# EAGLE design BreadBoard (EAGLE 6.4)
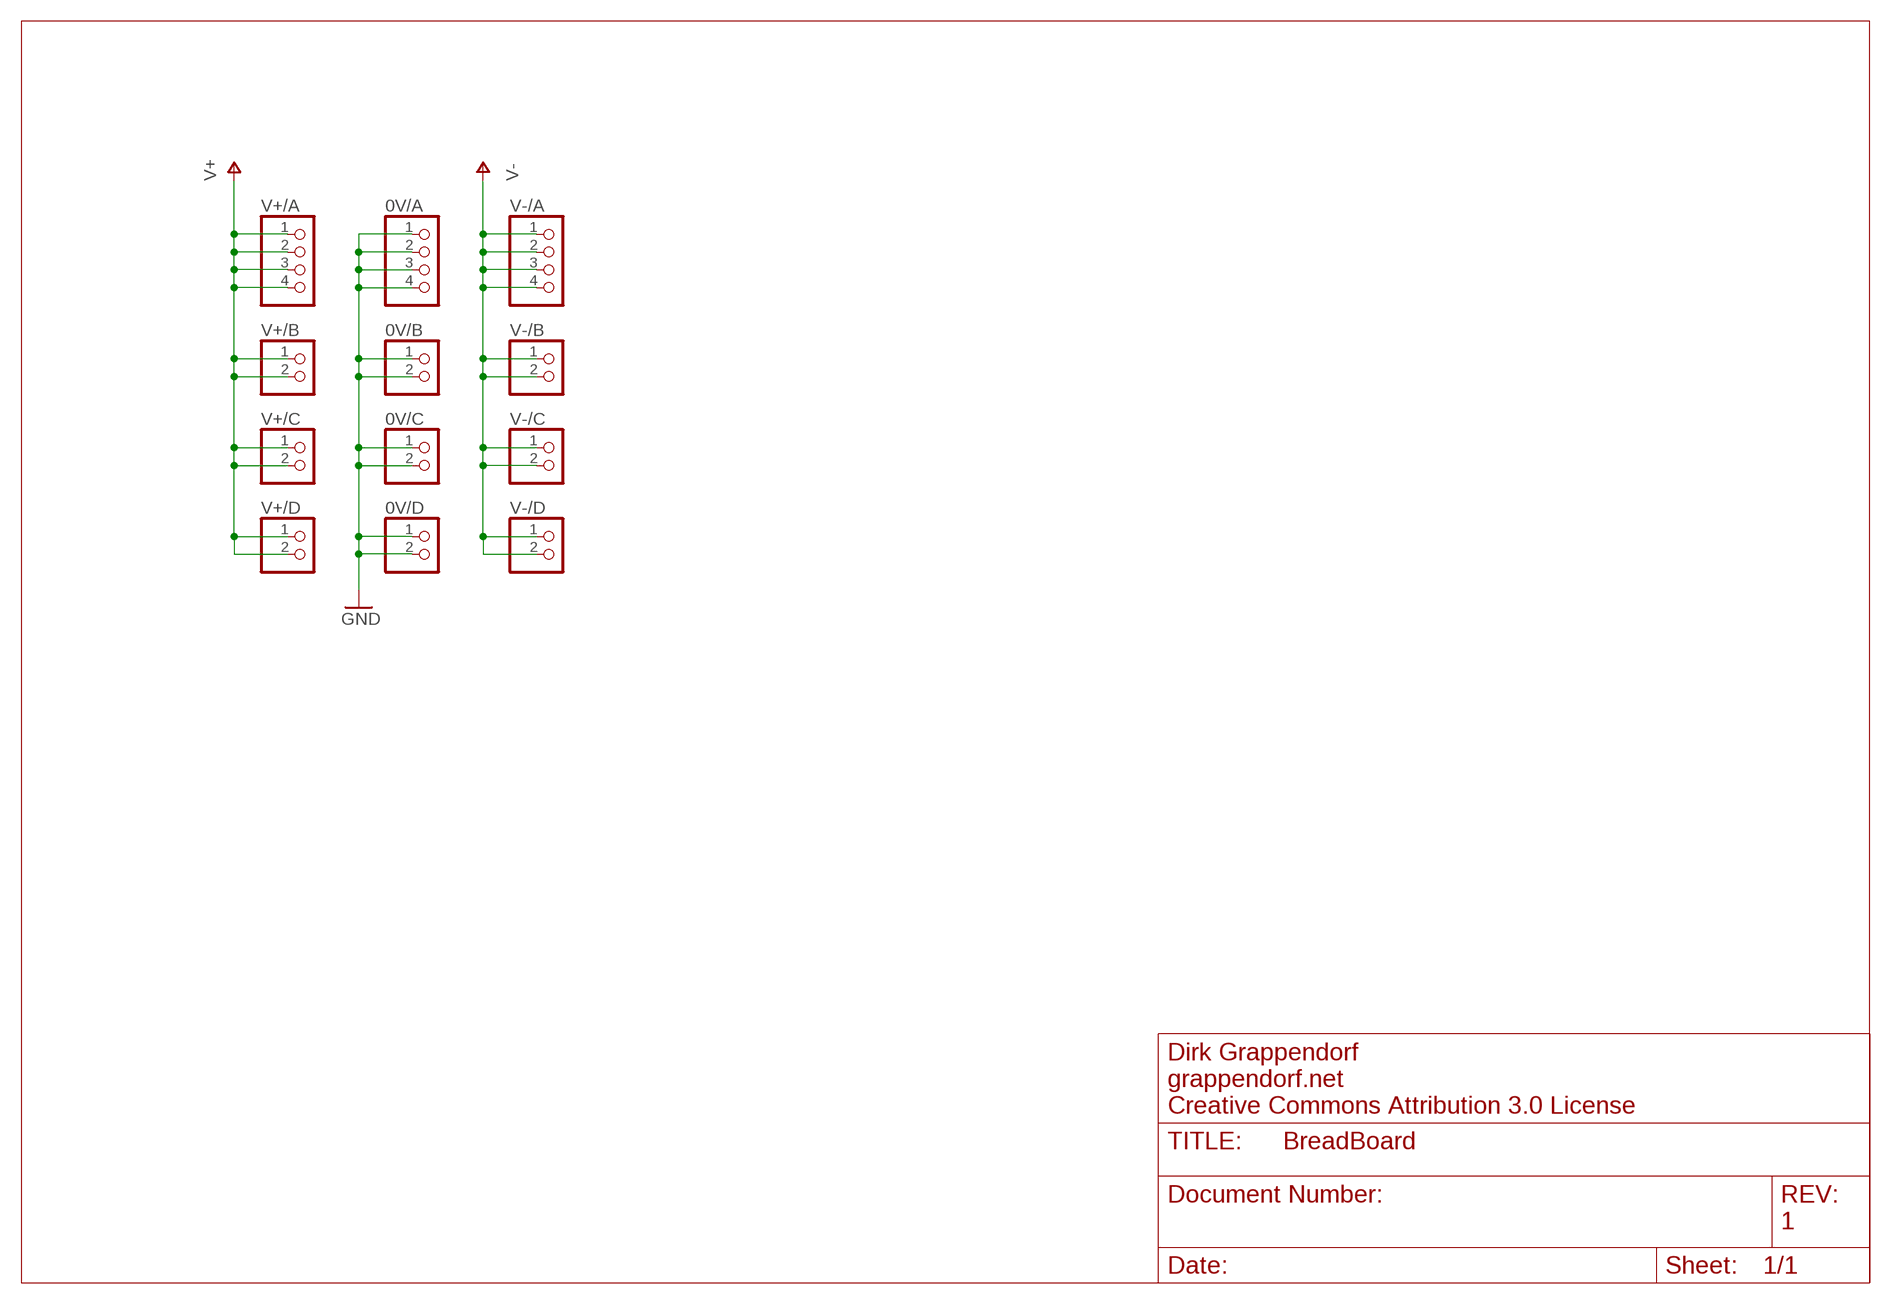
[diagram p0: schematic, sheet 1]

## Parts
0V/A  PINHD-1X4  [1X04]
0V/B  PINHD-1X2  [1X02]
0V/C  PINHD-1X2  [1X02]
0V/D  PINHD-1X2  [1X02]
V+/A  PINHD-1X4  [1X04]
V+/B  PINHD-1X2  [1X02]
V+/C  PINHD-1X2  [1X02]
V+/D  PINHD-1X2  [1X02]
V-/A  PINHD-1X4  [1X04]
V-/B  PINHD-1X2  [1X02]
V-/C  PINHD-1X2  [1X02]
V-/D  PINHD-1X2  [1X02]

## Nets
GND: 0V/A.1 0V/A.2 0V/A.3 0V/A.4 0V/B.1 0V/B.2 0V/C.1 0V/C.2 0V/D.1 0V/D.2
V+: V+/A.1 V+/A.2 V+/A.3 V+/A.4 V+/B.1 V+/B.2 V+/C.1 V+/C.2 V+/D.1 V+/D.2
V-: V-/A.1 V-/A.2 V-/A.3 V-/A.4 V-/B.1 V-/B.2 V-/C.1 V-/C.2 V-/D.1 V-/D.2

## Notes on the sheet
- Dirk Grappendorf
- grappendorf.net
- Creative Commons Attribution 3.0 License
- 1

## Library data of the parts
0V/A V+/A V-/A = pinhead:PINHD-1X4: PIN HEADER
0V/B 0V/C 0V/D V+/B V+/C V+/D V-/B V-/C V-/D = pinhead:PINHD-1X2: PIN HEADER

## Board
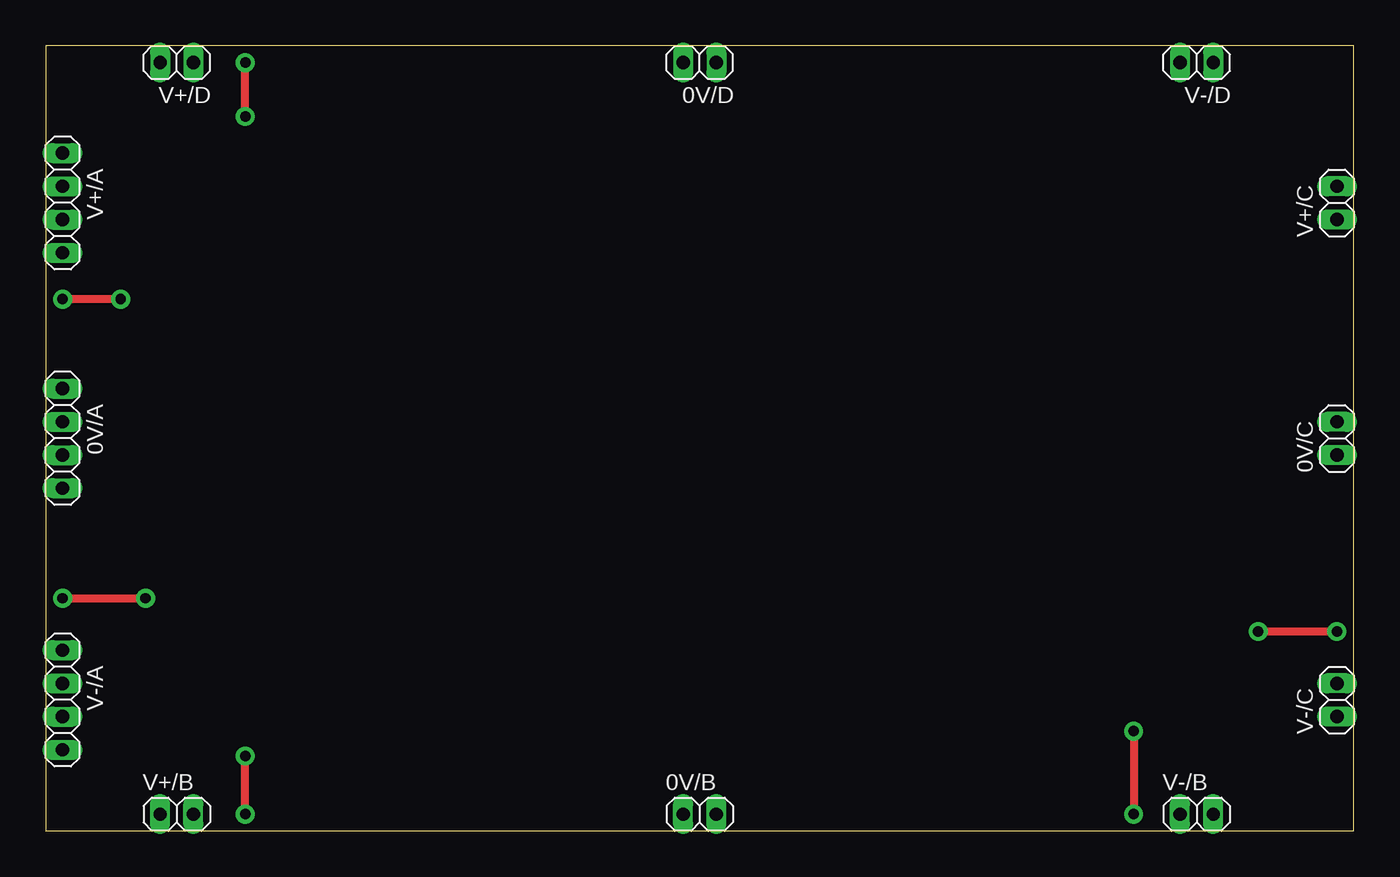
[diagram p1: board, top side]
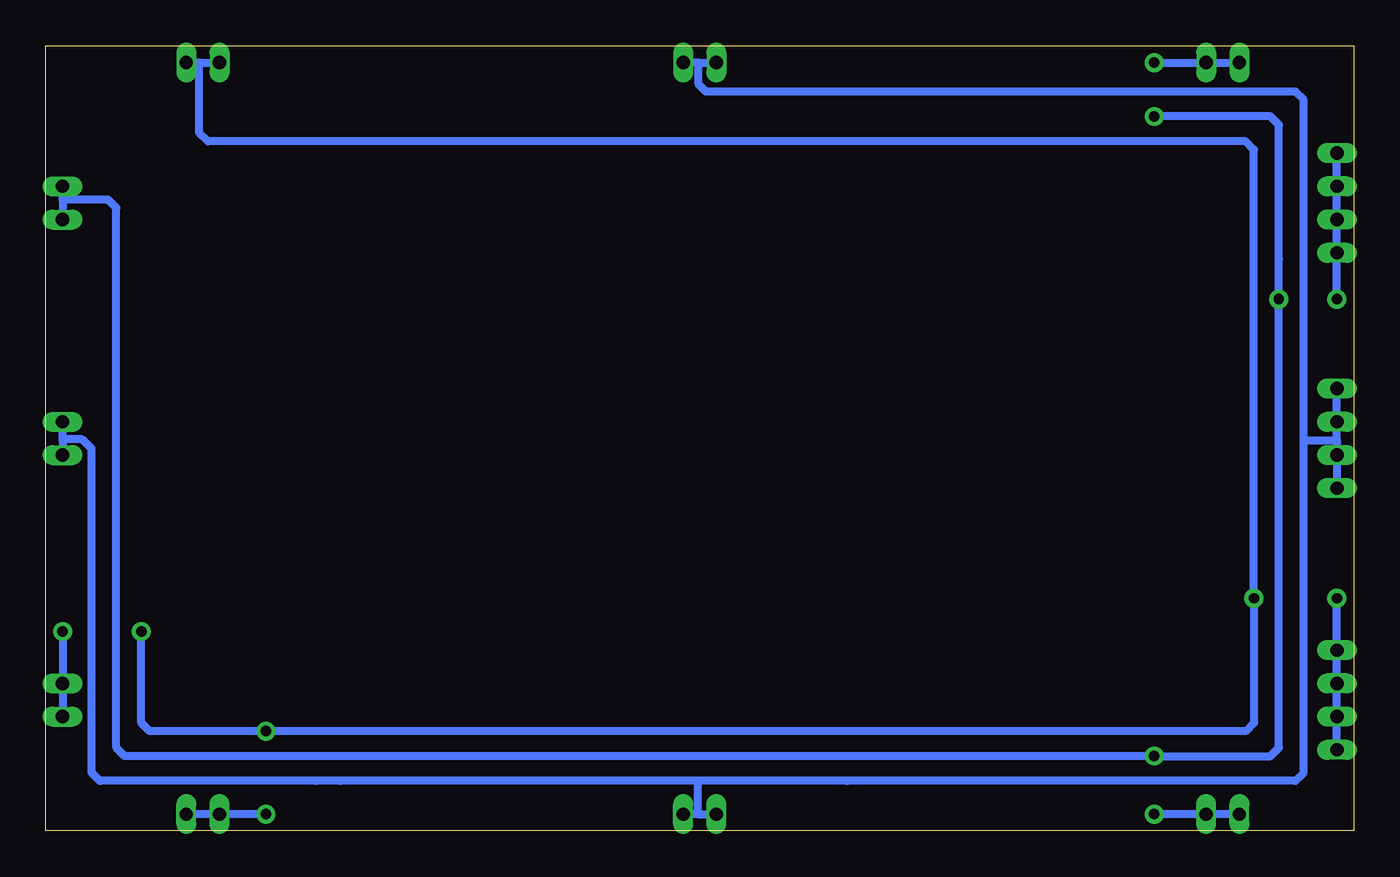
[diagram p2: board, bottom side, seen from below]

Size 100 x 60 mm. Coordinates in mm from the lower left corner, seen from the top.
Outline: 0,0 100,0 100,60 0,60 0,0
Copper layers (1*16): Top 0.035mm / dielectric 1.5mm / Bottom 0.035mm
Design rules "default *": minimum track width 10mil, minimum drill 24mil, track to track 8mil, track to pad 8mil, pad to pad 8mil, via to via 8mil, smd to smd 8mil, copper to edge 40mil, drill to drill 8mil, minimum pad ring 10mil, minimum via ring 8mil, stop-mask expansion 4mil, vias tented up to drill 0mil, thermal gap 10mil

### Footprints (pad centres in the part's own frame; a part is rotated, then mirrored left to right if it is on the bottom)
1X04 = drill 1.016 long: 1 -3.81,0; 2 -1.27,0; 3 1.27,0; 4 3.81,0
1X02 = drill 1.016 long: 1 -1.27,0; 2 1.27,0

### Placement (x,y rotation side)
0V/A  1.27,30 270 top
0V/B  50,1.27 0 top
0V/C  98.73,30 90 top
0V/D  50,58.73 180 top
V+/A  1.27,48 270 top
V+/B  10,1.27 0 top
V+/C  98.73,48 90 top
V+/D  10,58.73 180 top
V-/A  1.27,10 270 top
V-/B  88,1.27 0 top
V-/C  98.73,10 90 top
V-/D  88,58.73 180 top

### Tracks (layer width: path | path; a pad name or v marks a point on that pad's centre or on a via)
GND
  Bottom 0.61: 50.08,58.73 0V/D.2 | 50.08,58.73 0V/D.1 | 98.73,29.93 0V/C.1 98.48,28.48 | 98.73,29.93 0V/C.2 | 50.16,1.27 0V/B.1 | 50.16,1.27 0V/B.2 | 3.81,29.84 3.81,5.08 3.81,4.45 4.45,3.81 38.73,3.81 50.16,3.81 | 3.81,29.84 3.81,55.88 4.45,56.52 49.53,56.52 50.08,57.06 50.08,58.73 | 50.16,3.81 77.47,3.81 | 77.47,3.81 79.38,3.81 | 79.38,3.81 95.89,3.81 96.52,4.45 96.52,29.21 97.24,29.93 98.73,29.93 | 50.16,3.81 50.16,1.27 | 77.47,3.81 79.38,3.81 | 0V/A.1 0V/A.2 1.27,29.84 | 1.27,29.84 0V/A.3 0V/A.4 | 3.81,29.84 1.27,29.84
V+  (via drill 0.8)
  Top 0.61: v5.71,40.64 v1.27,40.64 | v15.24,1.27 v15.24,5.71 | v15.24,54.61 v15.24,58.73
  Bottom 0.61: V+/D.2 V+/D.1 14.91,58.73 v15.24,58.73 | 98.73,48.26 V+/C.1 | 98.73,48.26 V+/C.2 | V+/B.1 V+/B.2 15.05,1.27 v15.24,1.27 | v5.71,40.64 5.71,6.35 6.35,5.71 v15.24,5.71 20.32,5.71 61.59,5.71 93.98,5.71 94.61,6.35 94.61,47.62 95.25,48.26 98.73,48.26 | v5.71,40.64 5.71,43.72 | v15.24,54.61 6.35,54.61 5.71,53.98 v5.71,40.64 | v1.27,40.64 V+/A.4 V+/A.3 V+/A.2 V+/A.1
V-  (via drill 0.8)
  Top 0.61: v1.27,17.78 v7.62,17.78 | v92.71,15.24 v98.73,15.24 | v83.19,7.62 v83.19,1.27
  Bottom 0.61: V-/C.1 V-/C.2 98.73,14.91 v98.73,15.24 | V-/B.2 V-/B.1 v83.19,1.27 | 88.27,58.73 V-/D.2 | 88.27,58.73 V-/D.1 | v92.71,15.24 92.71,8.26 92.08,7.62 v83.19,7.62 41.91,7.62 8.26,7.62 7.62,8.26 v7.62,17.78 7.62,52.07 8.26,52.7 87.63,52.7 88.27,53.34 88.27,58.73 | V-/A.4 V-/A.3 V-/A.2 V-/A.1 v1.27,17.78